# Altium schematic sheet FE.SchDoc
size A4
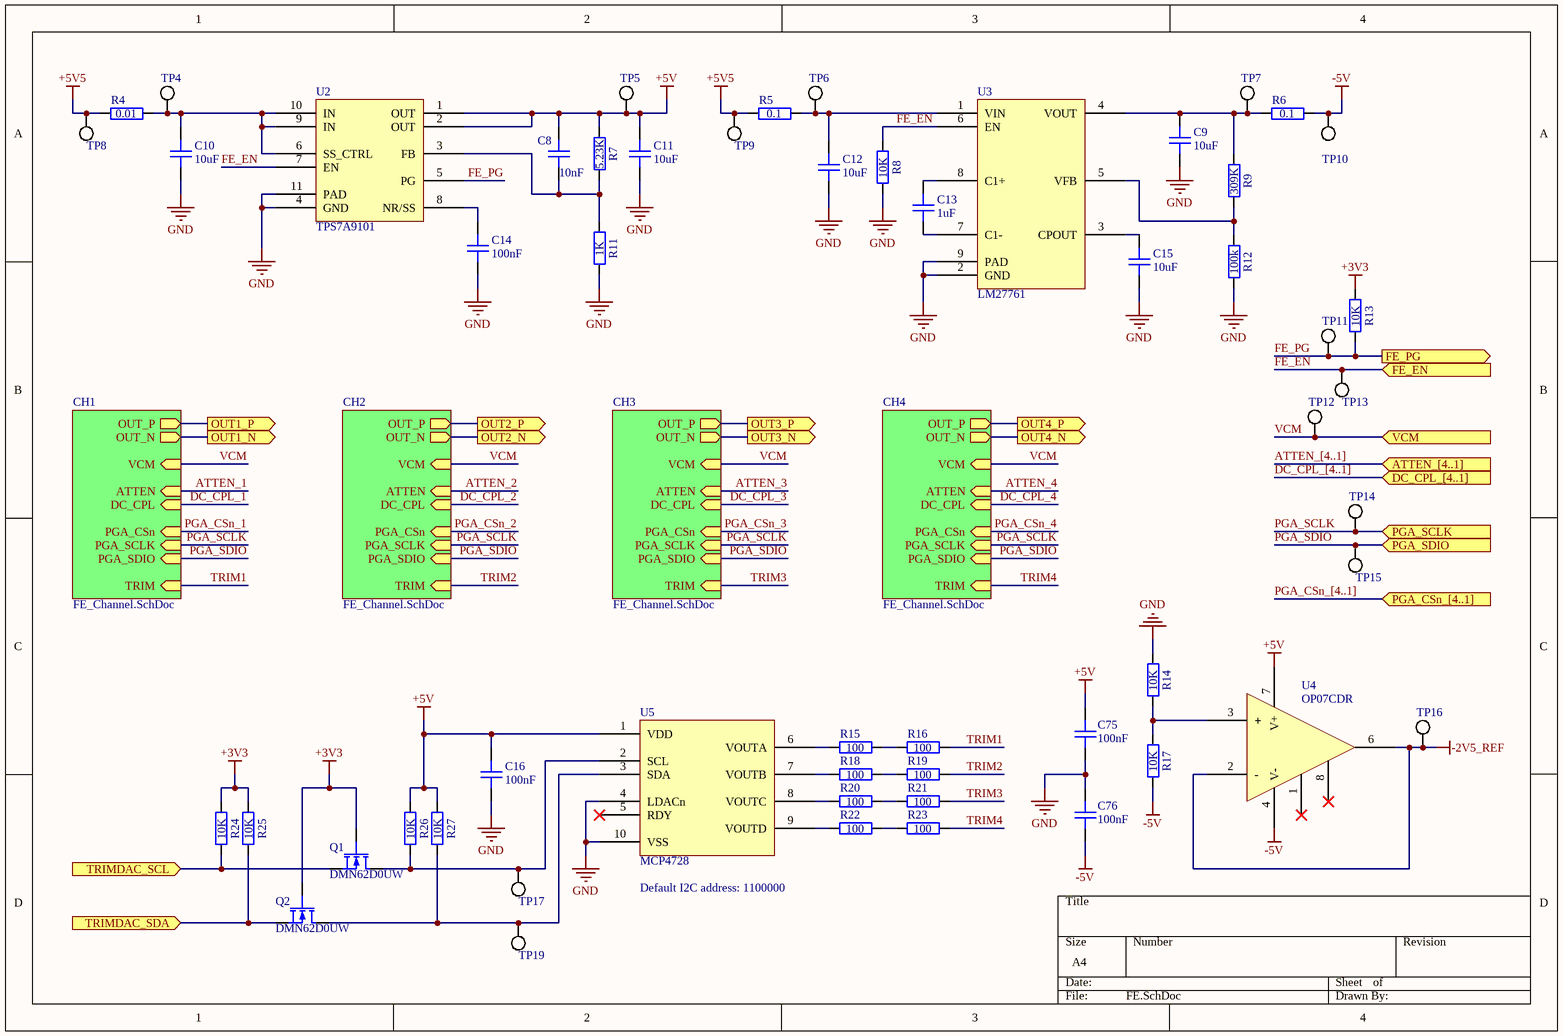
[diagram p0: FE.SchDoc]

## Parts
C8  10nF  [GEN_C_0402]
C9  10uF  [GEN_C_0603]
C10  10uF  [GEN_C_0603]
C11  10uF  [GEN_C_0603]
C12  10uF  [GEN_C_0603]
C13  1uF  [GEN_C_0402]
C14  100nF  [GEN_C_0402]
C15  10uF  [GEN_C_0603]
C16  100nF  [GEN_C_0402]
C75  100nF  [GEN_C_0402]
C76  100nF  [GEN_C_0402]
Q1  DMN62D0UW  [GEN_SOT_323]
Q2  DMN62D0UW  [GEN_SOT_323]
R4  0.01  [GEN_R_0603]
R5  0.1  [GEN_R_0402]
R6  0.1  [GEN_R_0402]
R7  5.23K  [GEN_R_0402]
R8  10K  [GEN_R_0402]
R9  309K  [GEN_R_0402]
R11  1K  [GEN_R_0402]
R12  100k  [GEN_R_0402]
R13  10K  [GEN_R_0402]
R14  10K  [GEN_R_0402]
R15  100  [GEN_R_0402]
R16  100  [GEN_R_0402]
R17  10K  [GEN_R_0402]
R18  100  [GEN_R_0402]
R19  100  [GEN_R_0402]
R20  100  [GEN_R_0402]
R21  100  [GEN_R_0402]
R22  100  [GEN_R_0402]
R23  100  [GEN_R_0402]
R24  10K  [GEN_R_0402]
R25  10K  [GEN_R_0402]
R26  10K  [GEN_R_0402]
R27  10K  [GEN_R_0402]
TP4  PCB  [GEN_TP_PCB]  (value not drawn)  (no BOM)
TP5  PCB  [GEN_TP_PCB]  (value not drawn)  (no BOM)
TP6  PCB  [GEN_TP_PCB]  (value not drawn)  (no BOM)
TP7  PCB  [GEN_TP_PCB]  (value not drawn)  (no BOM)
TP8  PCB  [GEN_TP_PCB]  (value not drawn)  (no BOM)
TP9  PCB  [GEN_TP_PCB]  (value not drawn)  (no BOM)
TP10  PCB  [GEN_TP_PCB]  (value not drawn)  (no BOM)
TP11  PCB  [GEN_TP_PCB]  (value not drawn)  (no BOM)
TP12  PCB  [GEN_TP_PCB]  (value not drawn)  (no BOM)
TP13  PCB  [GEN_TP_PCB]  (value not drawn)  (no BOM)
TP14  PCB  [GEN_TP_PCB]  (value not drawn)  (no BOM)
TP15  PCB  [GEN_TP_PCB]  (value not drawn)  (no BOM)
TP16  PCB  [GEN_TP_PCB]  (value not drawn)  (no BOM)
TP17  PCB  [GEN_TP_PCB]  (value not drawn)  (no BOM)
TP19  PCB  [GEN_TP_PCB]  (value not drawn)  (no BOM)
U2  TPS7A9101  [TI_WSON10_DSK0010A]
U3  LM27761  [TI_WSON8_DSG0008A]
U4  OP07CDR  [TI_SOIC8_D0008A]
U5  MCP4728  [MC_MSOP10_UN]

## Sub-sheets
CH1 = FE_Channel.SchDoc: OUT_P (out), VCM (in), OUT_N (out), TRIM (in), ATTEN (in), DC_CPL (in), PGA_CSn (in), PGA_SCLK (in), PGA_SDIO (in)
CH2 = FE_Channel.SchDoc: OUT_P (out), VCM (in), OUT_N (out), TRIM (in), ATTEN (in), DC_CPL (in), PGA_CSn (in), PGA_SCLK (in), PGA_SDIO (in)
CH3 = FE_Channel.SchDoc: OUT_P (out), VCM (in), OUT_N (out), TRIM (in), ATTEN (in), DC_CPL (in), PGA_CSn (in), PGA_SCLK (in), PGA_SDIO (in)
CH4 = FE_Channel.SchDoc: OUT_P (out), VCM (in), OUT_N (out), TRIM (in), ATTEN (in), DC_CPL (in), PGA_CSn (in), PGA_SCLK (in), PGA_SDIO (in)

## Ports
ATTEN_[4..1] (in), DC_CPL_[4..1] (in), FE_EN (in), FE_PG (out), OUT1_N (out), OUT1_P (out), OUT2_N (out), OUT2_P (out), OUT3_N (out), OUT3_P (out), OUT4_N (out), OUT4_P (out), PGA_CSn_[4..1] (in), PGA_SCLK (in), PGA_SDIO (in), TRIMDAC_SCL (in), TRIMDAC_SDA (in), VCM (in)

## Nets
+3V3: Q1.2(G) Q2.2(G) R13.2 R24.2 R25.2
+5V: C8.2 C11.2 C16.2 C75.1 R7.2 R26.2 R27.2 TP5.1 U2.1(OUT) U2.2(OUT) U4.7(V+) U5.1(VDD)
+5V5: R4.1 R5.1 TP8.1 TP9.1
-2V5_REF: TP16.1 U4.2(-) U4.6(OUT)
-5V: C76.2 R6.2 R17.1 TP10.1 U4.4(V-)
GND: C9.1 C10.1 C11.1 C12.1 C14.1 C15.1 C16.1 C75.2 C76.1 R8.1 R11.1 R12.1 R14.2 U2.4(GND) U2.11(PAD) U3.2(GND) U3.9(PAD) U5.4(LDACn) U5.10(VSS)
ATTEN_1: sheet CH1/ATTEN
ATTEN_2: sheet CH2/ATTEN
ATTEN_3: sheet CH3/ATTEN
ATTEN_4: sheet CH4/ATTEN
DC_CPL_1: sheet CH1/DC_CPL
DC_CPL_2: sheet CH2/DC_CPL
DC_CPL_3: sheet CH3/DC_CPL
DC_CPL_4: sheet CH4/DC_CPL
FE_EN: R8.2 TP13.1 U2.7(EN) U3.6(EN) ; port FE_EN
FE_PG: R13.1 TP11.1 U2.5(PG) ; port FE_PG
OUT1_N: port OUT1_N, sheet CH1/OUT_N
OUT1_P: port OUT1_P, sheet CH1/OUT_P
OUT2_N: port OUT2_N, sheet CH2/OUT_N
OUT2_P: port OUT2_P, sheet CH2/OUT_P
OUT3_N: port OUT3_N, sheet CH3/OUT_N
OUT3_P: port OUT3_P, sheet CH3/OUT_P
OUT4_N: port OUT4_N, sheet CH4/OUT_N
OUT4_P: port OUT4_P, sheet CH4/OUT_P
PGA_CSn_1: sheet CH1/PGA_CSn
PGA_CSn_2: sheet CH2/PGA_CSn
PGA_CSn_3: sheet CH3/PGA_CSn
PGA_CSn_4: sheet CH4/PGA_CSn
PGA_SCLK: TP14.1 ; port PGA_SCLK, sheet CH1/PGA_SCLK, sheet CH2/PGA_SCLK, sheet CH3/PGA_SCLK, sheet CH4/PGA_SCLK
PGA_SDIO: TP15.1 ; port PGA_SDIO, sheet CH1/PGA_SDIO, sheet CH2/PGA_SDIO, sheet CH3/PGA_SDIO, sheet CH4/PGA_SDIO
TRIM1: R16.1 ; sheet CH1/TRIM
TRIM2: R19.1 ; sheet CH2/TRIM
TRIM3: R21.1 ; sheet CH3/TRIM
TRIM4: R23.1 ; sheet CH4/TRIM
TRIMDAC_SCL: Q1.3(S) R24.1 ; port TRIMDAC_SCL
TRIMDAC_SDA: Q2.3(S) R25.1 ; port TRIMDAC_SDA
VCM: TP12.1 ; port VCM, sheet CH1/VCM, sheet CH2/VCM, sheet CH3/VCM, sheet CH4/VCM
NetC8_1: C8.1 R7.1 R11.2 U2.3(FB)
NetC9_2: C9.2 R6.1 R9.2 TP7.1 U3.4(VOUT)
NetC10_2: C10.2 R4.2 TP4.1 U2.6(SS_CTRL) U2.9(IN) U2.10(IN)
NetC12_2: C12.2 R5.2 TP6.1 U3.1(VIN)
NetC13_1: C13.1 U3.7(C1-)
NetC13_2: C13.2 U3.8(C1+)
NetC14_2: C14.2 U2.8(NR/SS)
NetC15_2: C15.2 U3.3(CPOUT)
NetQ1_1: Q1.1(D) R26.1 TP17.1 U5.2(SCL)
NetQ2_1: Q2.1(D) R27.1 TP19.1 U5.3(SDA)
NetR9_1: R9.1 R12.2 U3.5(VFB)
NetR14_1: R14.1 R17.2 U4.3(+)
NetR15_1: R15.1 R16.2
NetR15_2: R15.2 U5.6(VOUTA)
NetR18_1: R18.1 R19.2
NetR18_2: R18.2 U5.7(VOUTB)
NetR20_1: R20.1 R21.2
NetR20_2: R20.2 U5.8(VOUTC)
NetR22_1: R22.1 R23.2
NetR22_2: R22.2 U5.9(VOUTD)

Not connected (* = marked no-connect by the designer): U4 1(N1)* 8(N2)*; U5 5(RDY)*

## Buses and harness runs
bus ATTEN_[4..1] = port ATTEN_[4..1]
bus DC_CPL_[4..1] = port DC_CPL_[4..1]
bus PGA_CSn_[4..1] = port PGA_CSn_[4..1]

## Notes on the sheet
- Default I2C address: 1100000

## Library data of the parts
C8 = CAP 10nF 50V X7R 0402: Voltage Rating: 50V; Package: 0402; Supplier 1: Digi-Key; Supplier Part Number 1: 490-6351-1-ND; Value: 10nF
C9-C12 C15 = CAP 10uF 10V X5R 0603: Voltage Rating: 10V; Package: 0402; Supplier 1: Digi-Key; Supplier Part Number 1: 490-10474-1-ND; Value: 10uF
C13 = CAP 1uF 25V X5R 0402: Voltage Rating: 25V; Package: 0402; Supplier 1: Digi-Key; Supplier Part Number 1: 490-10017-1-ND; Value: 1uF
C14 C16 C75 C76 = CAP 100nF 16V X7R 0402: Voltage Rating: 16V; Package: 0402; Supplier 1: Digi-Key; Supplier Part Number 1: 490-4759-1-ND; Value: 100nF
Q1 Q2 = NMOS DMN62D0UW: Vdss: 60V; Id: 340mA; Max Power: 320mW; Supplier 1: Digi-Key; Supplier Part Number 1: DMN62D0UW-7DICT-ND
R4 = RES 0.01 OHM 1% 1/4W 0603: Tolerance: 1%; Power Rating: 0.25W; Supplier 1: Digi-Key; Supplier Part Number 1: 408-1404-1-ND; Value: 0.01; Package: 0603
R5 R6 = RES 0.1 OHM 1% 1/6W 0402: Tolerance: 1%; Power Rating: 0.16W; Package: 0402; Supplier 1: Digi-Key; Supplier Part Number 1: P.10AKCT-ND; Value: 0.1
R7 = RES 5.23K OHM 1% 1/16W 0402: Tolerance: 1%; Power Rating: 0.0625W; Package: 0402; Value: 5.23K; Supplier 1: Digi-Key; Supplier Part Number 1: YAG3195CT-ND
R8 R13 R14 R17 R24-R27 = RES 10K OHM 1% 1/10W 0402: Tolerance: 1%; Power Rating: 0.1W; Package: 0402; Supplier 1: Digi-Key; Supplier Part Number 1: P10.0KLCT-ND; Value: 10K
R9 = RES 309K OHM 1% 1/16W 0402: Tolerance: 1%; Power Rating: 0.0625W; Package: 0402; Supplier 1: Digi-Key; Supplier Part Number 1: YAG3108CT-ND; Value: 309K
R11 = RES 1K OHM 1% 1/10W 0402: Tolerance: 1%; Power Rating: 0.1W; Package: 0402; Supplier 1: Digi-Key; Supplier Part Number 1: 311-1.00KLRCT-ND; Value: 1K
R12 = RES 100K OHM 1% 1/10W 0402: Tolerance: 1%; Power Rating: 0.1W; Package: 0402; Supplier 1: Digi-Key; Supplier Part Number 1: 311-100KLRCT-ND; Value: 100k
R15 R16 R18-R23 = RES 100 OHM 1% 1/10W 0402: Tolerance: 1%; Power Rating: 0.1W; Package: 0402; Supplier 1: Digi-Key; Supplier Part Number 1: 2019-RK73H1ETTP1000FCT-ND; Value: 100
TP4-TP17 TP19 = TP PCB 1mm
U2 = IC LDO TPS7A9101: Supplier 1: Digi-Key; Supplier Part Number 1: 296-45298-1-ND
U3 = IC CPUMP LM27761: Supplier 1: Digi-Key; Supplier Part Number 1: 296-44379-1-ND
U4 = IC OPAMP OP07CDR: Supplier 1: Digi-Key; Supplier Part Number 1: 296-14626-1-ND
U5 = IC DAC QUAD MCP4728: Supplier 1: Digi-Key; Supplier Part Number 1: MCP4728A1T-E/UNCT-ND